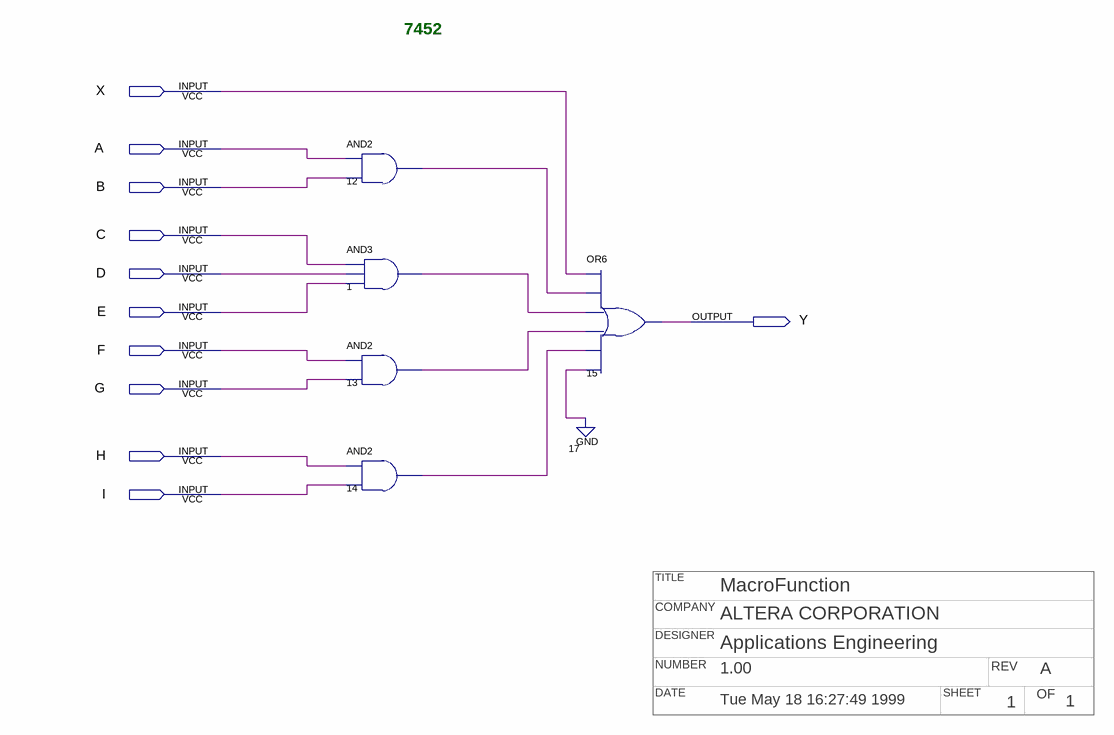
[diagram p0: schematic sheet]
// Quartus schematic 7452.bdf as structural Verilog: 5 symbols, 11 pins
// Title block: TITLE: MacroFunction; COMPANY: ALTERA CORPORATION; DESIGNER: Applications Engineering; NUMBER: 1.00; REV: A; DATE: Tue May 18 16:27:49 1999; SHEET: 1; OF: 1
module \7452  (
  input  X,
  input  A,
  input  B,
  input  C,
  input  D,
  input  E,
  input  F,
  input  G,
  input  H,
  input  I,
  output Y
);

  wire n1_out, n12_out, n13_out, n14_out;

  and u_12 (n12_out, A, B);
  and u_1 (n1_out, C, D, E);
  and u_13 (n13_out, F, G);
  and u_14 (n14_out, H, I);
  or u_15 (Y, X, n12_out, n1_out, n13_out, n14_out, 1'b0);

  // Notes on the sheet:
  //   7452
endmodule
